# EAGLE design lab!aa (EAGLE 9.6.2)
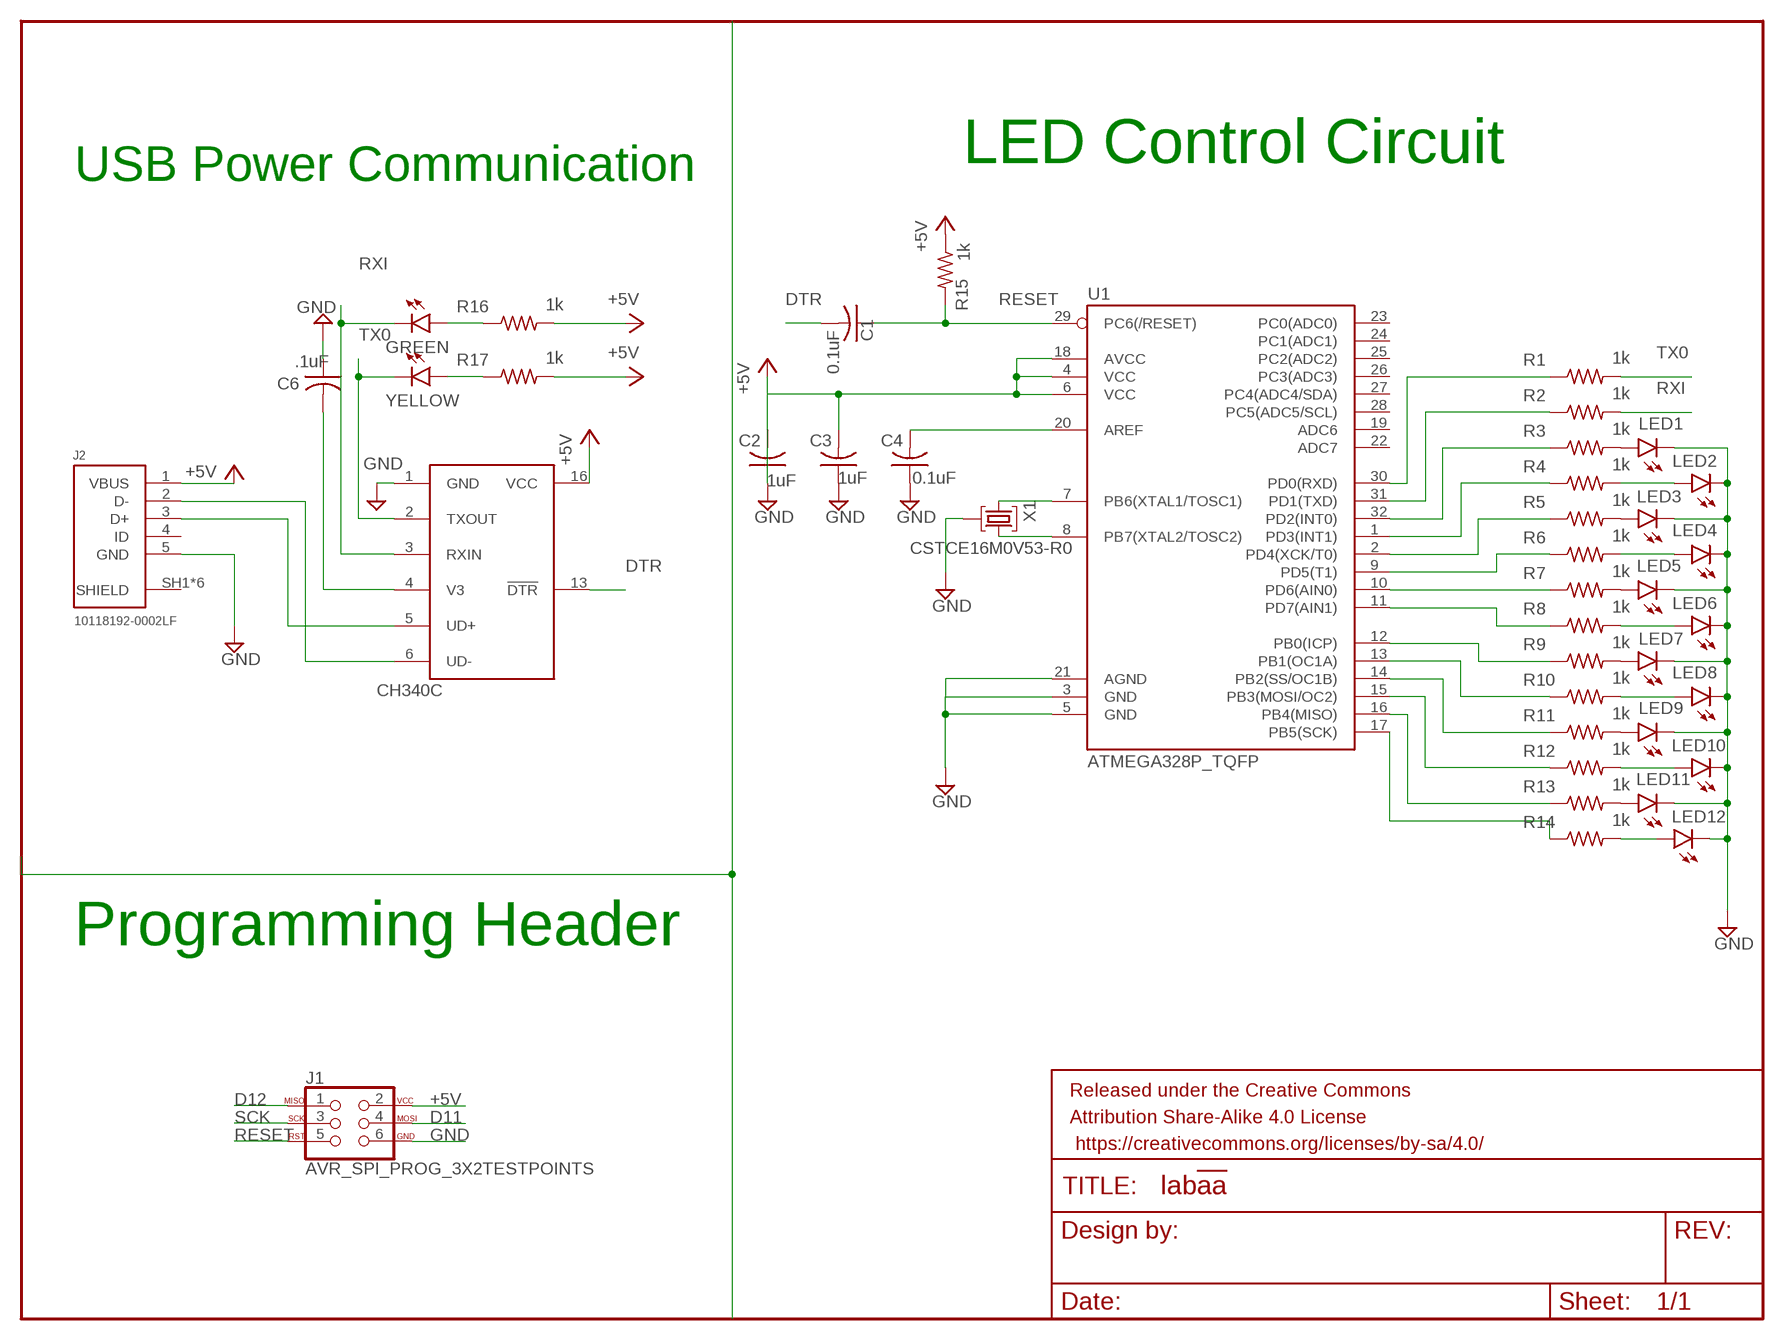
[diagram p0: schematic, sheet 1]

## Parts
C1  0.1uF  C-USC0805  [C0805]
C2  1uF  C-USC0805  [C0805]
C3  1uF  C-USC0805  [C0805]
C4  0.1uF  C-USC0805  [C0805]
C6  .1uF  C-USC0805  [C0805]
FRAME1  FRAME-LETTERNO_PACKAGE  [DUMMY]
GREEN  LEDCHIP-LED0805  [CHIP-LED0805]
J1  AVR_SPI_PROG_3X2TESTPOINTS  [2X3_TEST_POINTS]
J2  10118192-0002LF  [10118192-0002LF]
LED1  LEDCHIP-LED0805  [CHIP-LED0805]
LED2  LEDCHIP-LED0805  [CHIP-LED0805]
LED3  LEDCHIP-LED0805  [CHIP-LED0805]
LED4  LEDCHIP-LED0805  [CHIP-LED0805]
LED5  LEDCHIP-LED0805  [CHIP-LED0805]
LED6  LEDCHIP-LED0805  [CHIP-LED0805]
LED7  LEDCHIP-LED0805  [CHIP-LED0805]
LED8  LEDCHIP-LED0805  [CHIP-LED0805]
LED9  LEDCHIP-LED0805  [CHIP-LED0805]
LED10  LEDCHIP-LED0805  [CHIP-LED0805]
LED11  LEDCHIP-LED0805  [CHIP-LED0805]
LED12  LEDCHIP-LED0805  [CHIP-LED0805]
R1  1k  R-US_M0805  [M0805]
R2  1k  R-US_M0805  [M0805]
R3  1k  R-US_M0805  [M0805]
R4  1k  R-US_M0805  [M0805]
R5  1k  R-US_M0805  [M0805]
R6  1k  R-US_M0805  [M0805]
R7  1k  R-US_M0805  [M0805]
R8  1k  R-US_M0805  [M0805]
R9  1k  R-US_M0805  [M0805]
R10  1k  R-US_M0805  [M0805]
R11  1k  R-US_M0805  [M0805]
R12  1k  R-US_M0805  [M0805]
R13  1k  R-US_M0805  [M0805]
R14  1k  R-US_M0805  [M0805]
R15  1k  R-US_M0805  [M0805]
R16  1k  R-US_M0805  [M0805]
R17  1k  R-US_M0805  [M0805]
U1  ATMEGA328P_TQFP  [TQFP32-08]
U$1  CH340C  [SOP16]
X1  CSTCE16M0V53-R0  [CSTCE16M0V53-R0]
YELLOW  LEDCHIP-LED0805  [CHIP-LED0805]

## Nets
+5V: J1.2 J2.1(VBUS) R15.1 R16.2 R17.2 U$1.16(VCC)
D11: J1.4
D12: J1.1
DTR: C1.2 U$1.13(!DTR)
GND: C2.1 C2.2 C3.1 C3.2 C4.1 C6.1 J1.6 J2.5(GND) LED1.C LED2.C LED3.C LED4.C LED5.C LED6.C LED7.C LED8.C LED9.C LED10.C LED11.C LED12.C U1.3(GND) U1.4(VCC) U1.5(GND) U1.6(VCC) U1.7(PB6(XTAL1/TOSC1)) U1.18(AVCC) U1.21(AGND) U$1.1(GND) X1.1(INPUT) X1.2(GND) ; supply symbol labelled +5V
N$1: R1.1 U1.30(PD0(RXD))
N$2: R2.1 U1.31(PD1(TXD))
N$3: R3.1 U1.32(PD2(INT0))
N$4: R4.1 U1.1(PD3(INT1))
N$5: R5.1 U1.2(PD4(XCK/T0))
N$6: R6.1 U1.9(PD5(T1))
N$7: R7.1 U1.10(PD6(AIN0))
N$8: R8.1 U1.11(PD7(AIN1))
N$9: R9.1 U1.12(PB0(ICP))
N$10: R10.1 U1.13(PB1(OC1A))
N$11: R11.1 U1.14(PB2(SS/OC1B))
N$12: R12.1 U1.15(PB3(MOSI/OC2))
N$13: R13.1 U1.16(PB4(MISO))
N$14: R14.1 U1.17(PB5(SCK))
N$15: LED1.A R3.2
N$16: LED2.A R4.2
N$17: LED11.A R13.2
N$18: LED9.A R11.2
N$19: LED7.A R9.2
N$20: LED4.A R6.2
N$21: LED5.A R7.2
N$22: LED3.A R5.2
N$23: LED12.A R14.2
N$24: LED10.A R12.2
N$25: LED8.A R10.2
N$26: LED6.A R8.2
N$27: C4.2 U1.20(AREF)
N$28: U1.8(PB7(XTAL2/TOSC2)) X1.3(OUTPUT)
N$30: J2.2(D-) U$1.6(UD-)
N$31: J2.3(D+) U$1.5(UD+)
N$32: GREEN.A R16.1
N$33: R17.1 YELLOW.A
N$39: C6.2 U$1.4(V3)
RESET: C1.1 J1.5 R15.2 U1.29(PC6(/RESET))
RXI: GREEN.C R2.2 U$1.3(RXIN)
SCK: J1.3
TX0: R1.2 U$1.2(TXOUT) YELLOW.C
Unconnected: J2.4(ID) U1.19(ADC6) U1.22(ADC7) U1.23(PC0(ADC0)) U1.24(PC1(ADC1)) U1.25(PC2(ADC2)) U1.26(PC3(ADC3)) U1.27(PC4(ADC4/SDA)) U1.28(PC5(ADC5/SCL))

## Notes on the sheet
- LED Control Circuit
- USB Power Communication
- Programming Header

## Power pins joined to a net without a drawn wire
SHIELD: J2.SH1(SHIELD) J2.SH2(SHIELD) J2.SH3(SHIELD) J2.SH4(SHIELD) J2.SH5(SHIELD) J2.SH6(SHIELD)

## Library data of the parts
C1-C4 C6 = adafruit:C-US: CAPACITOR, American symbol
FRAME1 = SparkFun-Aesthetics:FRAME-LETTER: Schematic Frame - Letter Standard 8.5x11 US Letter frame; DESIGNER: Nobody; VERSION: v01
GREEN LED1-LED12 YELLOW = led:LED: LED OSRAM: - CHIPLED LG R971, LG N971, LY N971, LG Q971, LY Q971, LO R971, LY R971 LH N974, LH R974 LS Q976, LO Q976, LY Q976 LO Q996 - Hyper CHIPLED LW Q18S LB Q993, LB Q99A, LB R99A - SideLED LS A670, LO A670, LY A670, LG A670, LP A670 LB A673, LV A673, LT A673, LW A673 LH A674 LY A675 LS A676, LA A676, LO A676, LY A676, LW A676 LS A679, LY A679, LG A679 - Hyper Micro SIDELED® LS Y876, LA Y876, LO Y876, LY Y876 LT Y87S - SmartLED LW L88C, LW L88S LB L89C, LB L89S, LG L890 LS L89K, LO L89K, LY L89K LS L896, LA L896, LO L896, LY L896 - TOPLED LS T670, LO T670, LY T670, LG T670, LP T670 LSG T670, LSP T670, LSY T670, LOP T670, LYG T670 LG T671, LOG T671, LSG T671 LB T673, LV T673, LT T673, LW T673 LH T674 LS T676, LA T676, LO T676, LY T676, LB T676, LH T676, LSB T676, LW T676 LB T67C, LV T67C, LT T67C, LS T67K, LO T67K, LY T67K, LW E67C LS E67B, LA E67B, LO E67B, LY E67B, LB E67C, LV E67C, LT E67C LW T67C LS T679, LY T679, LG T679 LS T770, LO T770, LY T770, LG T770, LP T770 LB T773, LV T773, LT T773, LW T773 LH T774 LS E675, LA E675, LY E675, LS T675 LS T776, LA T776, LO T776, LY T776, LB T776 LHGB T686 LT T68C, LB T68C - Hyper Mini TOPLED® LB M676 - Mini TOPLED Santana® LG M470 LS M47K, LO M47K, LY M47K Source: http://www.osram.convergy.de LUXEON: - LUMILED® LXK2-PW12-R00, LXK2-PW12-S00, LXK2-PW14-U00, LXK2-PW14-V00 LXK2-PM12-R00, LXK2-PM12-S00, LXK2-PM14-U00 LXK2-PE12-Q00, LXK2-PE12-R00, LXK2-PE12-S00, LXK2-PE14-T00, LXK2-PE14-U00 LXK2-PB12-K00, LXK2-PB12-L00, LXK2-PB12-M00, LXK2-PB14-N00, LXK2-PB14-P00, LXK2-PB14-Q00 LXK2-PR12-L00, LXK2-PR12-M00, LXK2-PR14-Q00, LXK2-PR14-R00 LXK2-PD12-Q00, LXK2-PD12-R00, LXK2-PD12-S00 LXK2-PH12-R00, LXK2-PH12-S00 LXK2-PL12-P00, LXK2-PL12-Q00, LXK2-PL12-R00 Source: www.luxeon.com KINGBRIGHT: KA-3528ASYC Source: www.kingbright.com
J1 = SparkFun-Connectors:AVR_SPI_PROG_3X2: AVR ISP 6 Pin This is the reduced ISP connector for AVR programming. Common on Arduino. This footprint will take up less PCB space and can be used with a 10-pin to 6-pin adapter such as SKU: BOB-08508 **Special note about "TEST_POINT" package. The stop mask is on the top side, so if you want your programming test points to be on the bottom of your board, make sure to place this package on the bottom side of the board. This also ensure that the orientation to program from the bottom side will be correct. SparkFun Products: SparkFun ISP Pogo Adapter <https://www.sparkfun.com/products/11591> - NS Tiny AVR Programmer <https://www.sparkfun.com/products/11801> -PTH
J2 = USB connector:10118192-0002LF: CONN RCPT USB2.0 MICRO B SMD R/A Manufacturer's datasheet <https://www.amphenol-icc.com/media/wysiwyg/files/drawing/10118192.pdf>; CREATED_BY: PCBLayout.com; DIGIKEY_PARTNO: 609-5379-2-ND; MANUFACTURER: Amphenol ICC (FCI); MPN: 10118192-0002LF
R1-R17 = rcl:R-US_: RESISTOR, American symbol; SPICEPREFIX: R
U1 = SparkFun-IC-Microcontroller:ATMEGA328P_TQFP: Popular 328P in QFP Storefront component: ATmega328 - TQFP <https://www.sparkfun.com/products/13448> (COM-13448) Datasheet <http://www.sparkfun.com/datasheets/Components/SMD/ATMega328.pdf> SparkFun Products SparkFun RedBoard - Programmed with Arduino <https://www.sparkfun.com/products/12757> (DEV-12757) Arduino Pro Mini 328 - 5V/16MHz <https://www.sparkfun.com/products/11113> (DEV-11113) Arduino Pro Mini 328 - 3.3V/8MHz <https://www.sparkfun.com/products/11114> (DEV-11114) SparkFun OpenLog <https://www.sparkfun.com/products/13712> (DEV-13712) SparkFun MicroView - OLED Arduino Module <https://www.sparkfun.com/products/12923> (DEV-12923) SparkFun Digital Sandbox <https://www.sparkfun.com/products/12651> (DEV-12651) SparkFun PicoBoard <https://www.sparkfun.com/products/11888> (WIG-11888) Arduino Fio <https://www.sparkfun.com/products/10116> (DEV-10116) LilyPad Arduino 328 Main Board <https://www.sparkfun.com/products/13342> (DEV-13342) SparkFun RedStick <https://www.sparkfun.com/products/13741> (DEV-13741) LilyPad MP3 <https://www.sparkfun.com/products/11013> (DEV-11013) LilyPad Arduino SimpleSnap <https://www.sparkfun.com/products/10941> (DEV-10941) SparkFun Stepoko <https://www.sparkfun.com/products/13899> (ROB-13899) SparkFun Geiger Counter <https://www.sparkfun.com/products/11345> (SEN-11345) SparkFun EL Sequencer <https://www.sparkfun.com/products/12781> (COM-12781) Arduino Pro 328 - 5V/16MHz <https://www.sparkfun.com/products/10915> (DEV-10915) CryptoCape <https://www.sparkfun.com/products/12773> (DEV-12773) SparkFun IR Thermometer Evaluation Board - MLX90614 <https://www.sparkfun.com/products/10740> (SEN-10740) SparkFun RedBot Mainboard <https://www.sparkfun.com/products/12097> (ROB-12097) Arduino Pro 328 - 3.3V/8MHz <https://www.sparkfun.com/products/10914> (DEV-10914) SparkFun Block for Intel® Edison - Arduino <https://www.sparkfun.com/products/13036> (DEV-13036) SparkFun Simon Says - Surface Mount Soldering Kit <https://www.sparkfun.com/products/10935> (KIT-10935) SparkFun 7-Segment Serial Display - Red <https://www.sparkfun.com/products/11441> (COM-11441) SparkFun 7-Segment Serial Display - White <https://www.sparkfun.com/products/11629> (COM-11629) SparkFun 7-Segment Serial Display - Yellow <https://www.sparkfun.com/products/11443> (COM-11443) SparkFun 7-Segment Serial Display - Kelly Green <https://www.sparkfun.com/products/11440> (COM-11440) SparkFun 7-Segment Serial Display - Blue <https://www.sparkfun.com/products/11442> (COM-11442) SparkFun OpenSegment Serial Display - 20mm (Blue) <https://www.sparkfun.com/products/11647> (COM-11647) SparkFun OpenSegment Serial Display - 20mm (Green) <https://www.sparkfun.com/products/11646> (COM-11646) SparkFun OpenSegment Serial Display - 20mm (White) <https://www.sparkfun.com/products/11648> (COM-11648) SparkFun OpenSegment Serial Display - 20mm (Red) <https://www.sparkfun.com/products/11644> (COM-11644) SparkFun OpenSegment Serial Display - 20mm (Yellow) <https://www.sparkfun.com/products/11645> (COM-11645) SparkFun OpenSegment Shield <https://www.sparkfun.com/products/13190> (DEV-13190); PROD_ID: IC-09069
U$1 = CH340C:CH340C: CH340C USB to UART IC
X1 = Crystals_Oscillators:CSTCE16M0V53-R0: CER RES 16.0000MHZ 15PF SMD Manufacturer's datasheet <https://www.murata.com/~/media/webrenewal/support/library/catalog/products/timingdevice/ceralock/p16e.ashx>; CREATED_BY: PCBLayout.com; DIGIKEY_PART_NUMBER: 490-1198-2-ND; MANUFACTURER: Murata Electronics North America; MPN: CSTCE16M0V53-R0; PACKAGE: SMD 3

## Board
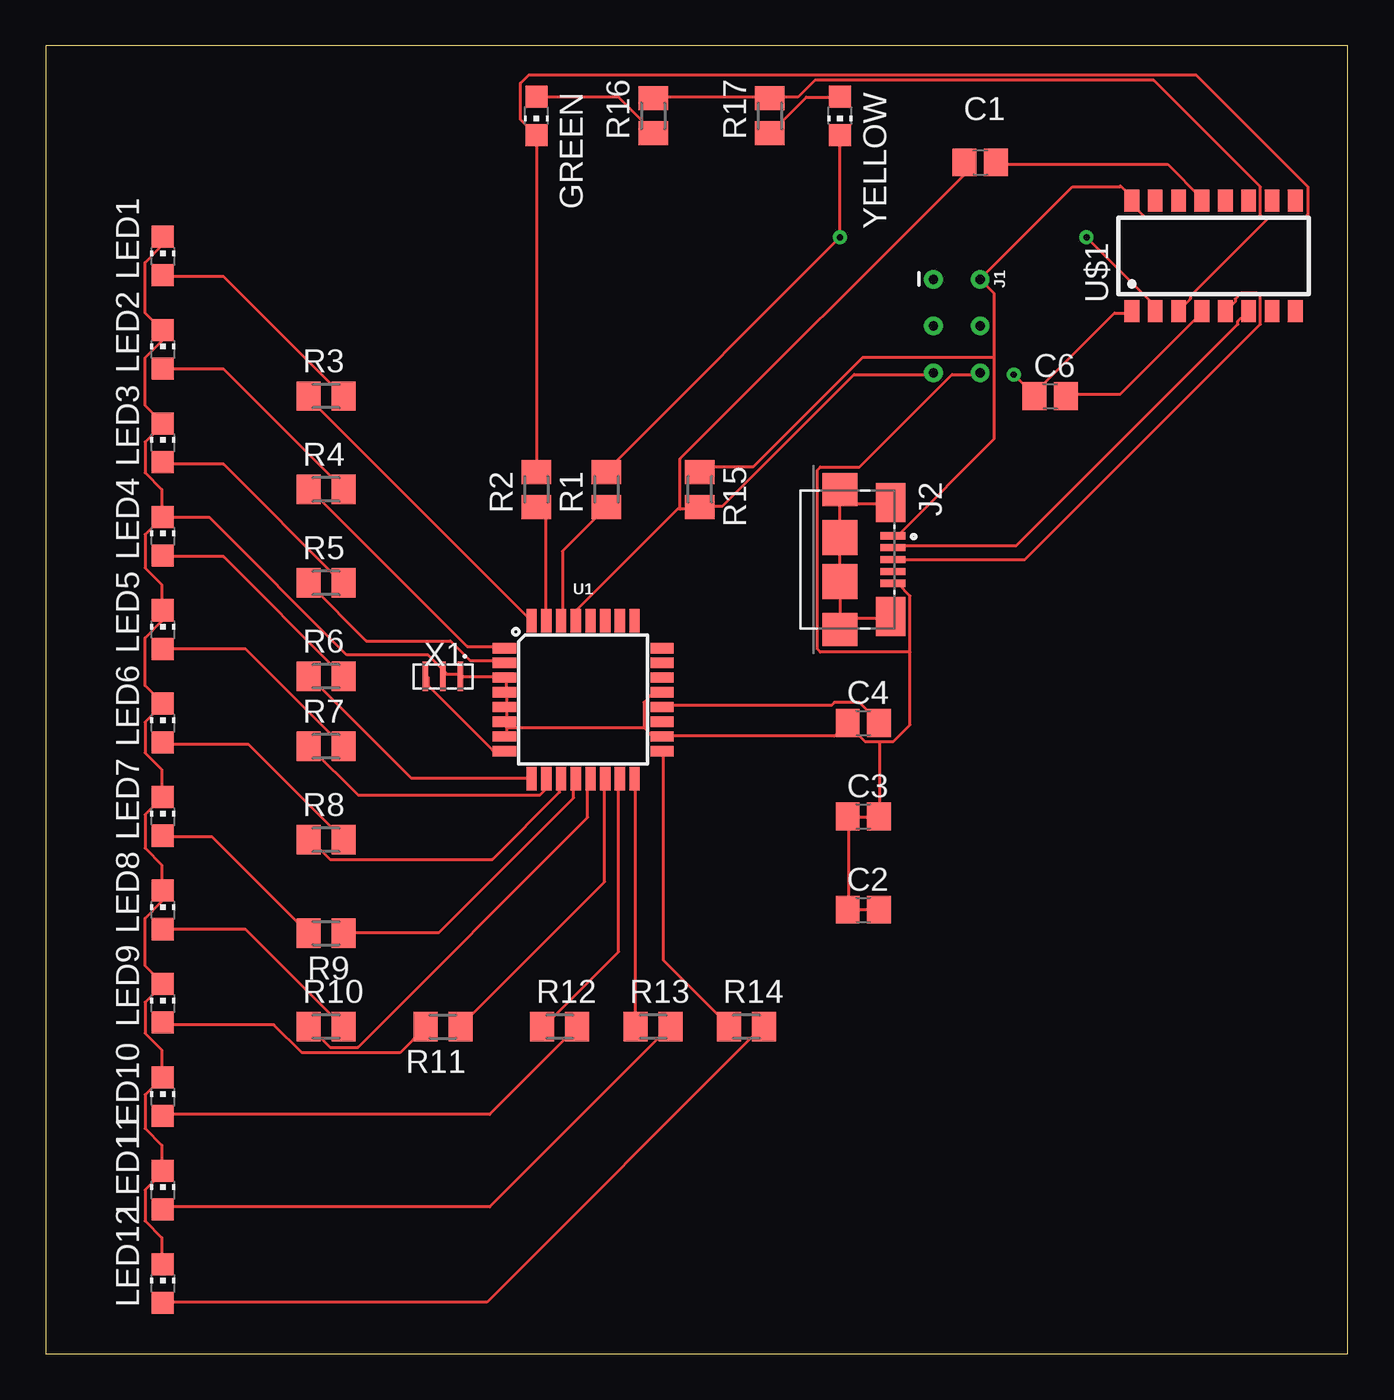
[diagram p1: board, top side]
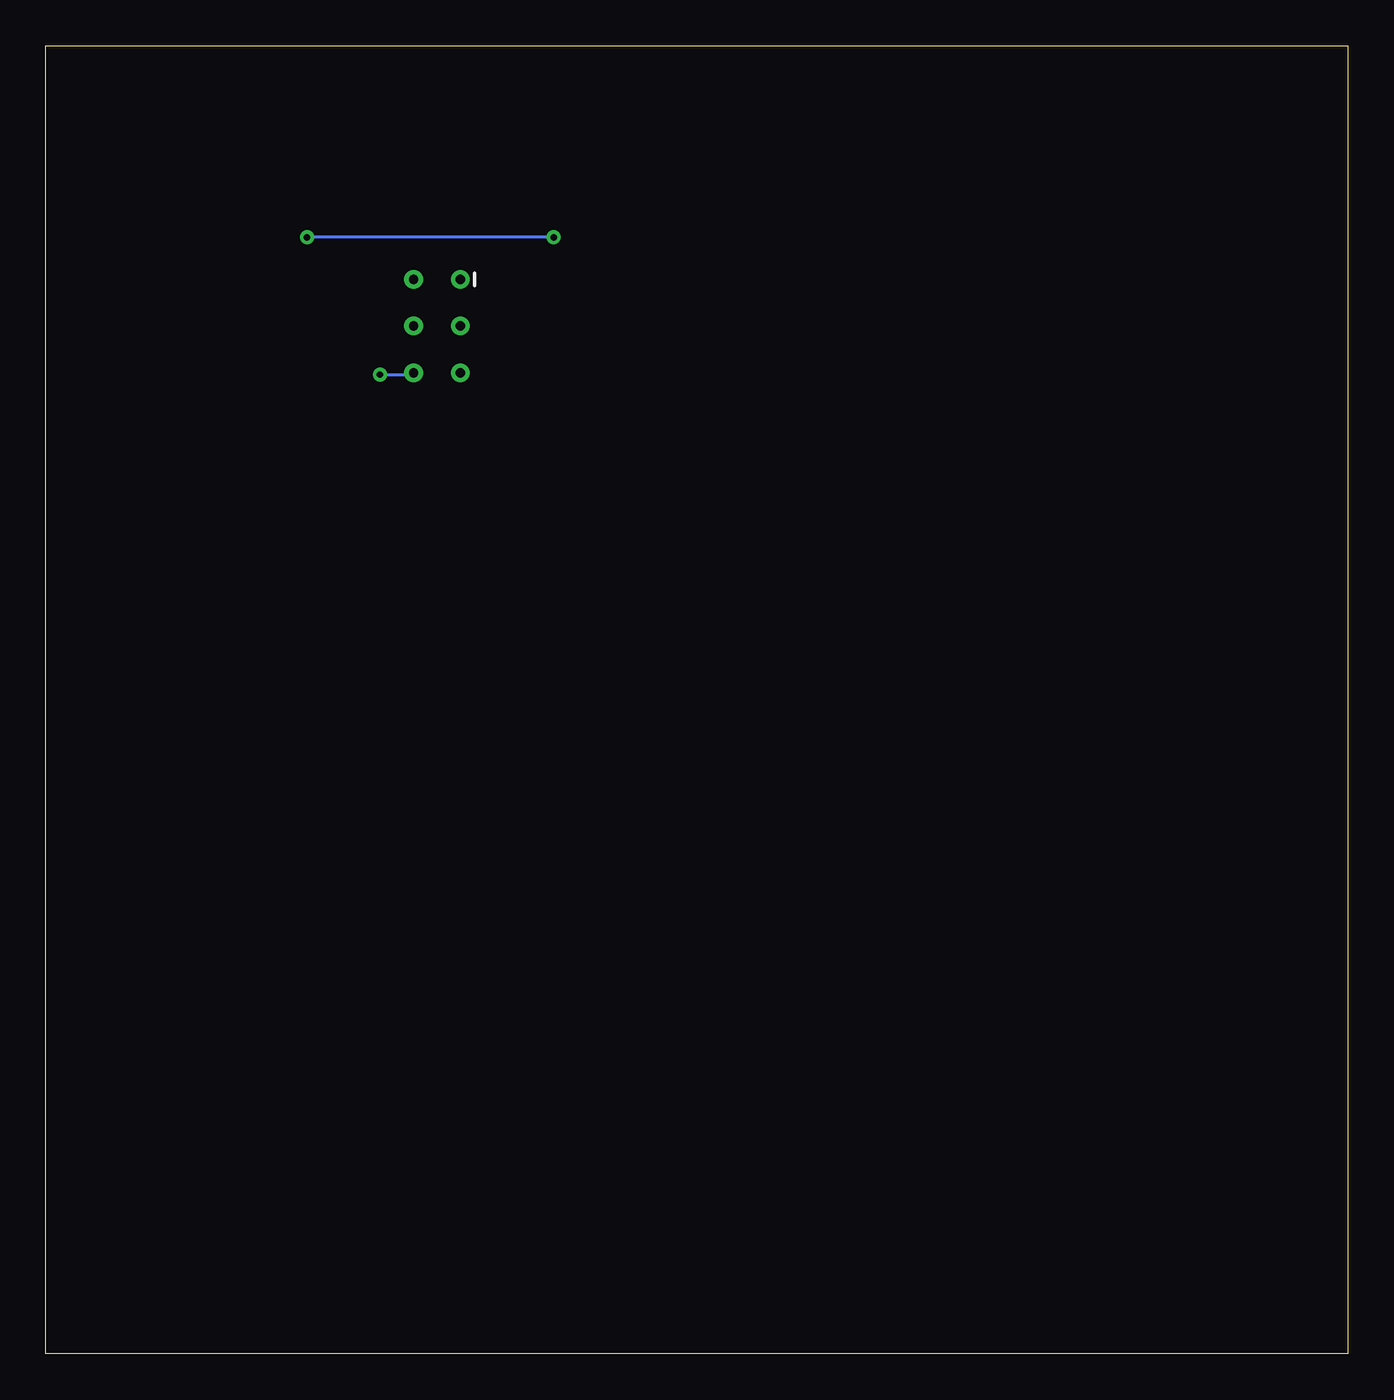
[diagram p2: board, bottom side, seen from below]

Size 70.79 x 71.11 mm. Coordinates in mm from the lower left corner, seen from the top.
Outline: 0,0 70.79,0 70.79,71.11 0,71.11 0,0
Copper layers (1*16): Top 0.035mm / dielectric 1.5mm / Bottom 0.035mm
Design rules "default": minimum track width 6mil, minimum drill 0.35mm, track to track 6mil, track to pad 6mil, pad to pad 6mil, via to via 6mil, smd to smd 6mil, copper to edge 40mil, drill to drill 6mil, minimum pad ring 10mil, minimum via ring 8mil, stop-mask expansion 4mil, vias tented up to drill 0mil, thermal gap 10mil

### Footprints (pad centres in the part's own frame; a part is rotated, then mirrored left to right if it is on the bottom)
C0805 = smd 1.3 x 1.5: 1 -0.85,0; 2 0.85,0
CHIP-LED0805 = smd 1.2 x 1.2: A 0,-1.05; C 0,1.05
2X3_TEST_POINTS = drill 0.508: 1 -2.54,-1.27; 2 -2.54,1.27; 3 0,-1.27; 4 0,1.27; 5 2.54,-1.27; 6 2.54,1.27
10118192-0002LF = smd 0.4 x 1.35: 1 -1.3,2.875; 2 -0.65,2.875; 3 0,2.875; 4 0.65,2.875; 5 1.3,2.875 | smd 2.1 x 1.6: SH1 -3.1,2.75; SH2 3.1,2.75 | smd 1.8 x 1.9: SH3 -3.8,0; SH4 3.8,0 | smd 1.9 x 1.9: SH5 -1.2,0; SH6 1.2,0
M0805 = smd 1.3 x 1.6: 1 -0.95,0; 2 0.95,0
TQFP32-08 = smd 1.27 x 0.559: 1 -4.293,2.8; 2 -4.293,2; 3 -4.293,1.2; 4 -4.293,0.4; 5 -4.293,-0.4; 6 -4.293,-1.2; 7 -4.293,-2; 8 -4.293,-2.8; 17 4.293,-2.8; 18 4.293,-2; 19 4.293,-1.2; 20 4.293,-0.4; 21 4.293,0.4; 22 4.293,1.2; 23 4.293,2; 24 4.293,2.8 | smd 0.559 x 1.27: 9 -2.8,-4.293; 10 -2,-4.293; 11 -1.2,-4.293; 12 -0.4,-4.293; 13 0.4,-4.293; 14 1.2,-4.293; 15 2,-4.293; 16 2.8,-4.293; 25 2.8,4.293; 26 2,4.293; 27 1.2,4.293; 28 0.4,4.293; 29 -0.4,4.293; 30 -1.2,4.293; 31 -2,4.293; 32 -2.8,4.293
SOP16 = smd 0.8 x 1.2: 1 -4.445,-3; 2 -3.175,-3; 3 -1.905,-3; 4 -0.635,-3; 5 0.635,-3; 6 1.905,-3; 7 3.175,-3; 8 4.445,-3; 9 4.445,3; 10 3.175,3; 11 1.905,3; 12 0.635,3; 13 -0.635,3; 14 -1.905,3; 15 -3.175,3; 16 -4.445,3
CSTCE16M0V53-R0 = smd 0.3 x 1.6: 1 0.95,0; 2 0,0; 3 -0.95,0

### Placement (x,y rotation side)
C1  50.8,64.77 0 top
C2  44.45,24.13 0 top
C3  44.45,29.21 0 top
C4  44.45,34.29 0 top
C6  54.61,52.07 0 top
FRAME1  -54.61,49.53 0 top  (outside the outline)
GREEN  26.67,67.31 180 top
J1  49.53,55.88 270 top
J2  43.18,43.18 270 top
LED1  6.35,59.69 0 top
LED2  6.35,54.61 0 top
LED3  6.35,49.53 0 top
LED4  6.35,44.45 0 top
LED5  6.35,39.37 0 top
LED6  6.35,34.29 0 top
LED7  6.35,29.21 0 top
LED8  6.35,24.13 0 top
LED9  6.35,19.05 0 top
LED10  6.35,13.97 0 top
LED11  6.35,8.89 0 top
LED12  6.35,3.81 0 top
R1  30.48,46.99 90 top
R2  26.67,46.99 90 top
R3  15.24,52.07 0 top
R4  15.24,46.99 0 top
R5  15.24,41.91 0 top
R6  15.24,36.83 0 top
R7  15.24,33.02 0 top
R8  15.24,27.94 0 top
R9  15.24,22.86 180 top
R10  15.24,17.78 0 top
R11  21.59,17.78 180 top
R12  27.94,17.78 0 top
R13  33.02,17.78 0 top
R14  38.1,17.78 0 top
R15  35.56,46.99 270 top
R16  33.02,67.31 90 top
R17  39.37,67.31 90 top
U1  29.21,35.56 0 top
U$1  63.5,59.69 0 top
X1  21.59,36.83 0 top
YELLOW  43.18,67.31 180 top

### Tracks (layer width: path | path; a pad name or v marks a point on that pad's centre or on a via)
+5V
  Top 0.152: 46.38,44.55 46.08,44.55 J2.1 46.38,44.55 | 35.71,48.21 35.56,48.06 R15.1 35.71,48.21 | 58.44,63.48 59.05,62.87 U$1.16 59.18,62.69 59.18,62.38 59.79,61.77 65.89,61.77 66.04,61.92 66.04,63.45 60.25,69.24 41.81,69.24 40.89,68.33 39.37,68.33 | 58.44,63.48 58.42,63.5 | 39.37,68.33 33.12,68.33 R16.2 | 58.44,63.48 58.42,63.45 55.83,63.45 J1.2 51.56,57.66 51.56,54.15 | 46.38,44.55 51.56,49.73 51.56,54.15 | 35.71,48.21 38.46,48.21 44.4,54.15 51.56,54.15 | 39.37,68.33 R17.2
DTR
  Top 0.152: U$1.13 62.84,62.84 61.01,64.67 51.71,64.67 C1.2
GND  (via drill 0.35)
  Top 0.152: 6.3,24.59 6.3,25.04 LED8.C | 6.3,39.83 6.3,40.28 LED5.C | 6.3,55.07 6.3,55.52 LED2.C | 6.3,60.25 6.3,60.71 LED1.C 6.3,60.25 | 32.51,34.04 32.97,33.58 33.43,33.58 U1.18 33.58,33.58 42.88,33.58 43.48,34.19 C4.1 43.64,34.19 44.55,33.27 45.31,33.27 | 32.51,34.04 32.51,35.41 32.97,35.86 33.43,35.86 U1.21 | 21.84,36.93 22.45,36.93 X1.1 22.61,36.78 24.89,36.78 U1.3 25.04,36.63 25.04,36.02 U1.4 25.04,35.86 25.04,35.25 U1.5 25.04,35.1 25.04,34.49 U1.6 25.04,34.34 25.04,34.04 | 21.84,36.93 21.69,36.93 X1.2 | 25.04,34.04 25.04,33.58 U1.7 | 25.04,34.04 32.51,34.04 | C2.2 43.64,24.13 | 43.64,29.16 45.16,29.16 C3.2 45.31,29.31 45.31,33.27 | 45.31,33.27 46.08,33.27 46.99,34.19 46.99,38.15 | J2.5 46.08,41.81 46.38,41.81 46.99,41.2 46.99,38.15 | 21.84,36.93 20.78,38 16.36,38 8.89,45.47 6.45,45.47 LED4.C | LED12.C 6.3,4.93 6.3,6.3 5.38,7.21 5.38,8.89 6.3,9.8 LED11.C 6.3,9.96 6.3,11.33 5.38,12.24 5.38,14.07 6.3,14.99 LED10.C 6.3,15.14 6.3,16.51 5.38,17.42 5.38,19.1 6.3,20.02 LED9.C 6.3,20.17 5.38,21.08 5.38,23.67 6.3,24.59 | 6.3,24.59 LED8.C | 6.3,39.83 5.38,38.91 5.38,36.32 6.3,35.41 LED6.C 6.3,35.25 5.38,34.34 5.38,32.66 6.3,31.75 6.3,30.38 LED7.C 6.3,30.23 5.38,29.31 5.38,27.48 6.3,26.57 6.3,25.2 LED8.C | 6.3,39.83 LED5.C | LED4.C 6.3,45.62 6.3,46.99 5.38,47.9 5.38,49.58 6.3,50.5 LED3.C 6.3,50.65 5.38,51.56 5.38,54.15 6.3,55.07 | 6.3,55.07 LED2.C | 6.3,60.25 5.38,59.33 5.38,56.59 6.3,55.68 LED2.C | LED5.C 6.3,40.44 6.3,41.81 5.38,42.72 5.38,44.55 6.3,45.47 LED4.C | 53.7,52.17 58.11,56.59 59.03,56.59 U$1.1 | 53.7,52.17 v52.63,53.24 | 53.7,52.17 C6.1 | 43.64,29.16 43.64,24.13
  Top 0.152: 43.64,24.13 C2.1 | 43.64,29.16 C3.1 | 46.99,38.15 42.11,38.15 41.96,38.3 41.96,48.06 42.11,48.21 44.25,48.21 49.28,53.24 50.8,53.24 J1.6
  Bottom 0.152: v52.63,53.24 50.8,53.24 J1.6
N$1
  Top 0.152: U1.30 28.09,39.98 28.09,43.64 30.38,45.92 R1.1
N$2
  Top 0.152: 27.18,45.47 26.72,45.92 R2.1 27.18,45.47 | 27.18,45.47 27.18,39.98 U1.31
N$3
  Top 0.152: U1.32 26.26,39.98 14.22,52.02 R3.1
N$4
  Top 0.152: U1.1 24.89,38.46 22.91,38.46 14.38,46.99 R4.1
N$5
  Top 0.152: U1.2 24.89,37.69 23.06,37.69 22,38.76 17.42,38.76 14.38,41.81 R5.1
N$6
  Top 0.152: U1.9 26.26,31.29 19.86,31.29 14.38,36.78 R6.1
N$7
  Top 0.152: 27.18,30.68 27.18,31.14 U1.10 27.18,30.68 | 27.18,30.68 26.87,30.38 16.97,30.38 14.38,32.97 R7.1
N$8
  Top 0.152: R8.1 14.38,27.94 15.44,26.87 24.28,26.87 27.94,30.53 27.94,31.14 U1.11
N$9
  Top 0.152: U1.12 28.7,31.14 28.7,30.23 21.39,22.91 16.2,22.91 R9.1
N$10
  Top 0.152: R10.1 14.38,17.73 15.44,16.66 16.97,16.66 29.46,29.16 29.46,31.14 U1.13
N$11
  Top 0.152: 22.55,17.88 R11.1 22.61,17.88 30.38,25.65 30.38,31.14 U1.14
N$12
  Top 0.152: 27.13,17.88 R12.1 27.18,17.88 31.14,21.84 31.14,31.14 U1.15
N$13
  Top 0.152: 32,17.88 R13.1 32.05,17.88 32.05,31.14 U1.16
N$14
  Top 0.152: 37.03,17.88 R14.1 37.08,17.88 33.58,21.39 33.58,32.66 U1.17
N$15
  Top 0.152: LED1.A 6.45,58.57 9.65,58.57 16.05,52.17 R3.2
N$16
  Top 0.152: LED2.A 6.45,53.54 9.65,53.54 16.2,46.99 R4.2
N$17
  Top 0.152: 33.83,17.73 R13.2 33.88,17.73 24.13,7.98 6.45,7.98 LED11.A
N$18
  Top 0.152: 20.57,17.73 R11.2 20.62,17.73 19.25,16.36 13.92,16.36 12.39,17.88 6.45,17.88 LED9.A
N$19
  Top 0.152: LED7.A 6.45,28.09 9.04,28.09 14.22,22.91 R9.2
N$20
  Top 0.152: LED4.A 6.45,43.33 9.65,43.33 16.05,36.93 R6.2
N$21
  Top 0.152: LED5.A 6.45,38.3 10.87,38.3 16.05,33.12 R7.2
N$22
  Top 0.152: LED3.A 6.45,48.36 9.65,48.36 16.05,41.96 R5.2
N$23
  Top 0.152: 39.01,17.73 R14.2 38.91,17.73 23.98,2.79 6.45,2.79 LED12.A
N$24
  Top 0.152: 28.8,17.73 R12.2 28.85,17.73 24.13,13 6.45,13 LED10.A
N$25
  Top 0.152: LED8.A 6.45,23.06 10.87,23.06 16.05,17.88 R10.2
N$26
  Top 0.152: LED6.A 6.45,33.12 11.02,33.12 16.2,27.94 R8.2
N$27
  Top 0.152: U1.20 33.58,35.25 42.72,35.25 42.88,35.41 44.25,35.41 45.31,34.34 C4.2
N$28
  Top 0.152: 20.78,36.32 20.78,36.78 X1.3 20.78,36.32 | U1.8 24.89,32.82 24.28,32.82 20.78,36.32
N$30
  Top 0.152: 65.41,56.52 U$1.6 65.28,56.59 64.82,56.13 64.82,55.98 52.78,43.94 46.08,43.94 J2.2
N$31
  Top 0.152: J2.3 53.24,43.18 66.04,55.98 66.04,57.51 65.89,57.66 64.97,57.66 64.67,57.35 64.67,57.2 64.21,56.74 U$1.5
N$32
  Top 0.152: GREEN.A 26.72,68.33 31.14,68.33 32.97,66.5 R16.1
N$33
  Top 0.152: YELLOW.A 43.18,68.33 41.35,68.33 39.37,66.34 R17.1
N$39
  Top 0.152: U$1.4 62.84,56.59 58.42,52.17 55.52,52.17 C6.2
RESET
  Top 0.152: 28.85,40.44 28.85,39.98 U1.29 28.85,40.44 | 34.49,45.92 34.34,45.92 28.85,40.44 | 48.21,53.39 J1.5 48.21,53.24 43.94,53.24 36.78,46.08 35.56,46.08 R15.2 35.56,45.92 34.49,45.92 | 34.49,45.92 34.49,48.67 49.89,64.06 49.89,64.67 C1.1
RXI
  Top 0.152: R2.2 26.72,48.06 26.72,66.19 GREEN.C 26.57,66.34 25.81,67.11 25.81,69.09 26.26,69.55 62.53,69.55 68.63,63.45 68.63,61.92 68.48,61.77 66.5,61.77 62.23,57.51 62.23,57.35 61.62,56.74 U$1.3
SHIELD
  Top 0.152: 43.18,46.23 J2.SH5 J2.SH6 43.18,40.13 43.18,39.98 | 43.18,46.23 J2.SH3 43.18,46.84 | 45.92,40.13 J2.SH2 45.92,39.98 43.18,39.98 | 43.18,39.52 J2.SH4 43.18,39.98 | 43.18,46.23 45.92,46.23 J2.SH1
TX0  (via drill 0.35)
  Top 0.152: YELLOW.C v43.18,60.71 30.53,48.06 R1.2 | v56.59,60.71 60.25,57.05 60.25,56.74 U$1.2
  Bottom 0.152: v43.18,60.71 v56.59,60.71